# EAGLE design childboard_relay_v1 (EAGLE 6.3)
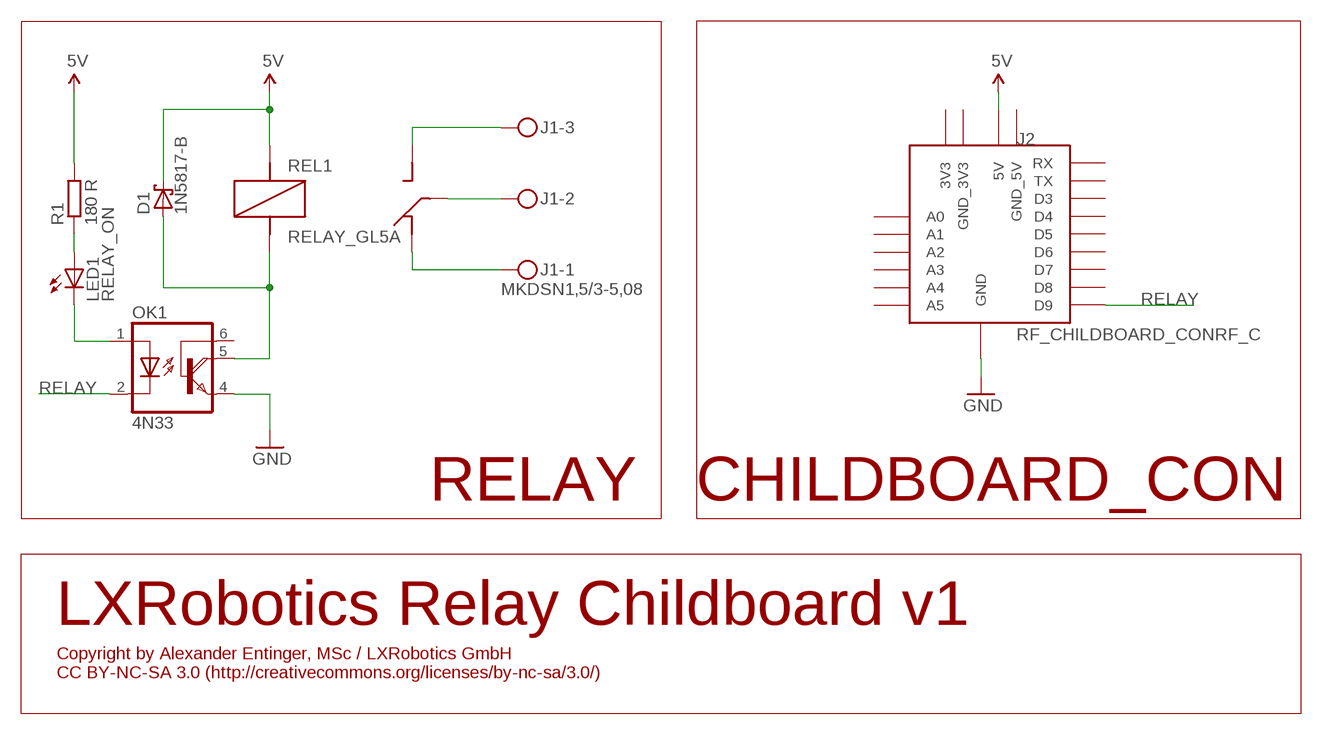
[diagram p0: schematic, sheet 1]

## Parts
D1  1N5817-B  [DO41-7.6]
J1  MKDSN1,5/3-5,08  [MKDSN1,5/3-5,08]
J2  RF_CHILDBOARD_CONRF_C  [RF_CHILDBOARD_CON]
LED1  RELAY_ON  LED5MM  [LED5MM]
OK1  4N33  [DIL06]
R1  180 R  R-EU_0204/7  [0204/7]
REL1  RELAY_GL5A  [RELAY_GL5A]

## Nets
5V: D1.C J2.5V R1.2 REL1.R2(R2_COIL1)
GND: J2.GND_(GND) OK1.4(E)
N$1: J1.2 REL1.R1(R1_COMMON)
N$2: J1.3 REL1.R3(R3_SW)
N$3: J1.1 REL1.R4(R4_SW)
N$4: LED1.K(C) OK1.1(A)
N$5: D1.A OK1.5(COL) REL1.R5(R5_COIL2)
N$8: LED1.A R1.1
RELAY: J2.D9 OK1.2(C)
Unconnected: J2.3V3 J2.A0 J2.A1 J2.A2 J2.A3 J2.A4 J2.A5 J2.D3 J2.D4 J2.D5 J2.D6 J2.D7 J2.D8 J2.GND_3V3 J2.GND_5V J2.RX J2.TX OK1.6(B)

## Notes on the sheet
- RELAY | CHILDBOARD_CON
- LXRobotics Relay Childboard v1
- Copyright by Alexander Entinger, MSc / LXRobotics GmbH 
  CC BY-NC-SA 3.0 (http://creativecommons.org/licenses/by-nc-sa/3.0/)

## Library data of the parts
D1 = diode:1N581*: 1.0A SCHOTTKY BARRIER RECTIFIER Source: http://www.diodes.com/datasheets/ds23001.pdf
J1 = con-phoenix-508:MKDSN1,5/3-5,08: MKDSN 1,5/ 3-5,08 Printklemme Nennstrom: 13,5 A Nennspannung: 250 V Rastermaß: 5,08 mm Polzahl: 3 Anschlussart: Schraubanschluss Montage: Löten Anschlussrichtung Leiter/Platine: 0 ° Artikelnummer: 1729131 Source: http://eshop.phoenixcontact.com .. 1729131.pdf; MPN: SMKDSN1,5/3-5,08; OC_FARNELL: 1792904; OC_NEWARK: 70R0299
J2 = lxrobotics:RF_CHILDBOARD_CON
LED1 = SparkFun-LED:LED: LEDs Standard schematic elements and footprints for 5mm, 3mm, 1206, and 0603 sized LEDs. 5mm - Spark Fun Electronics SKU : COM-00529 (and others)
OK1 = optocoupler:4N33: MOTOROLA OPTO COUPLER; MF: VISHAY/TELEFUNKEN; MPN: 4N33; OC_FARNELL: 1469601; OC_NEWARK: 88K1390
R1 = resistor:R-EU_: RESISTOR, European symbol
REL1 = lxrobotics:RELAY_GL5A

## Board
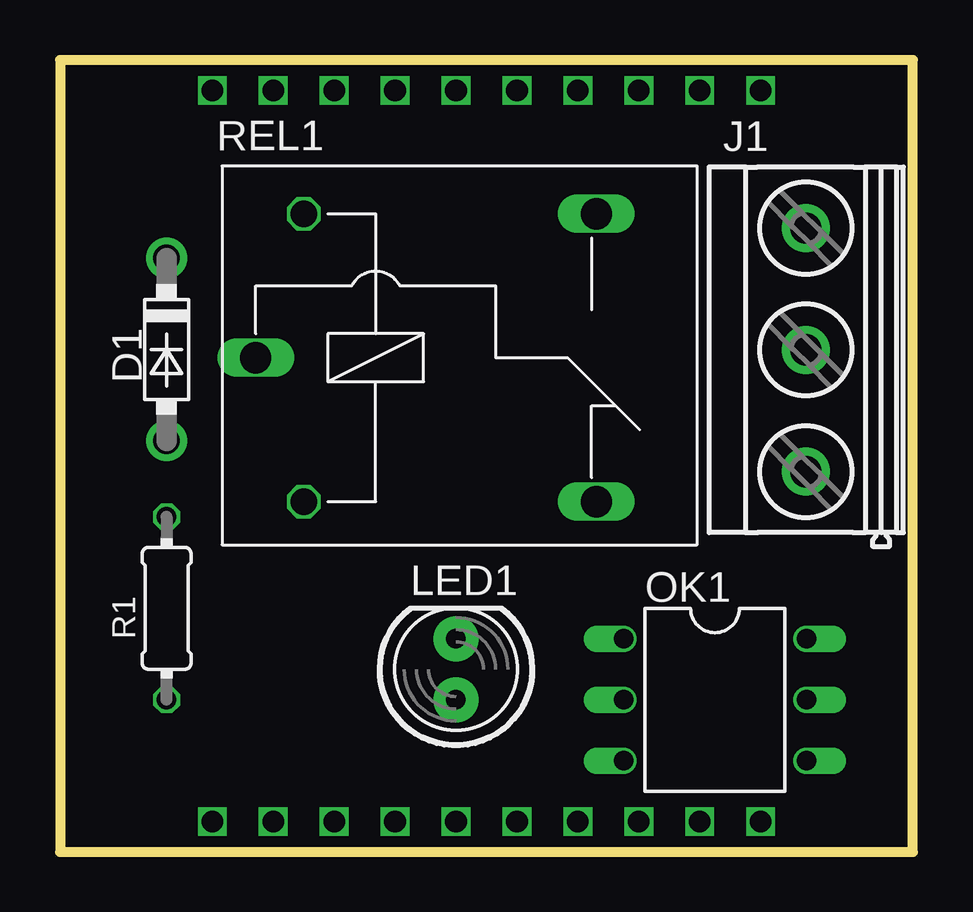
[diagram p1: board, top side]
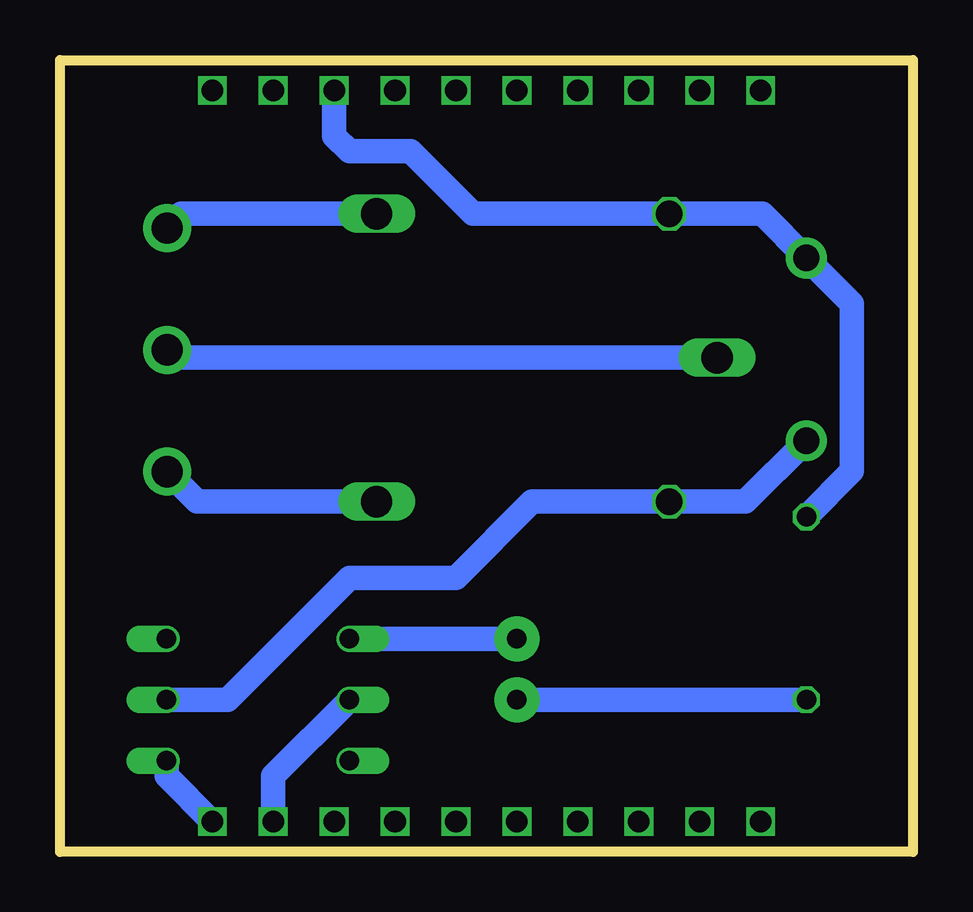
[diagram p2: board, bottom side, seen from below]

Size 35.56 x 33.02 mm. Coordinates in mm from the lower left corner, seen from the top.
Outline: 0,0 35.56,0 35.56,33.02 0,33.02 0,0
Copper layers (1*16): Top 0.035mm / dielectric 1.5mm / Bottom 0.035mm
Design rules "LeitOn - Standard-Eagle-DRU - 1- und  2-Lagen DK - deutsch - Rev 2.0": minimum track width 0.15mm, minimum drill 0.3mm, track to track 0.15mm, track to pad 0.15mm, pad to pad 0.15mm, via to via 0.15mm, smd to smd 0.15mm, copper to edge 0.3mm, drill to drill 0.3mm, minimum pad ring 0.15mm, minimum via ring 0.15mm, stop-mask expansion 0.075mm, vias tented up to drill 0mil, thermal gap 0.2mm

### Footprints (pad centres in the part's own frame; a part is rotated, then mirrored left to right if it is on the bottom)
DO41-7.6 = drill 1.1 pad 1.7: A 3.81,0; C -3.81,0
MKDSN1,5/3-5,08 = drill 1.3 pad 2: 1 -7.641,0.025; 2 -2.561,0.025; 3 2.519,0.025
RF_CHILDBOARD_CON = drill 0.9 square: 3V3 12.7,30.48; 5V 7.62,30.48; A0 2.54,30.48; A1 0,30.48; A2 -2.54,30.48; A3 -5.08,30.48; A4 -7.62,30.48; A5 -10.16,30.48; D3 -5.08,0; D4 -2.54,0; D5 0,0; D6 2.54,0; D7 5.08,0; D8 7.62,0; D9 10.16,0; GND_ 12.7,0; GND_3V3 10.16,30.48; GND_5V 5.08,30.48; RX -10.16,0; TX -7.62,0
LED5MM = drill 0.813 pad 1.88: A -1.27,0; K 1.27,0
DIL06 = drill 0.813 offset: 1 -2.54,-3.81; 2 0,-3.81; 3 2.54,-3.81; 4 2.54,3.81; 5 0,3.81; 6 -2.54,3.81
0204/7 = drill 0.813 octagon: 1 -3.81,0; 2 3.81,0
RELAY_GL5A = drill 1.3 long: R1 -2,6; R3 12.2,12; R4 12.2,0 | drill 1.1 octagon: R2 0,12; R5 0,0

### Placement (x,y rotation side)
D1  4.45,20.95 270 top
J1  31.11,23.49 90 top
J2  16.51,1.27 0 top
LED1  16.51,7.62 90 top
OK1  27.31,6.35 270 top
R1  4.45,10.16 90 top
REL1  10.16,14.6 0 top

### Tracks (layer width: path | path; a pad name or v marks a point on that pad's centre or on a via)
5V
  Bottom 1.016: R1.2 2.54,15.88 2.54,22.86 D1.C 6.29,26.6 REL1.R2 18.35,26.6 20.96,29.21 23.5,29.21 24.13,29.84 J2.5V
GND
  Bottom 1.016: J2.GND_ 31.11,3.17 OK1.4
N$1
  Bottom 1.016: REL1.R1 30.76,20.6 J1.2
N$2
  Bottom 1.016: REL1.R3 30.5,26.6 J1.3
N$3
  Bottom 1.016: J1.1 29.84,14.6 REL1.R4
N$4
  Bottom 1.016: OK1.1 LED1.K
N$5
  Bottom 1.016: D1.A 6.99,14.6 REL1.R5 15.88,14.6 19.05,11.43 23.5,11.43 28.57,6.35 OK1.5
N$8
  Bottom 1.016: LED1.A R1.1
RELAY
  Bottom 1.016: OK1.2 26.67,3.17 J2.D9